# Altium schematic sheet Keys.SchDoc
size A
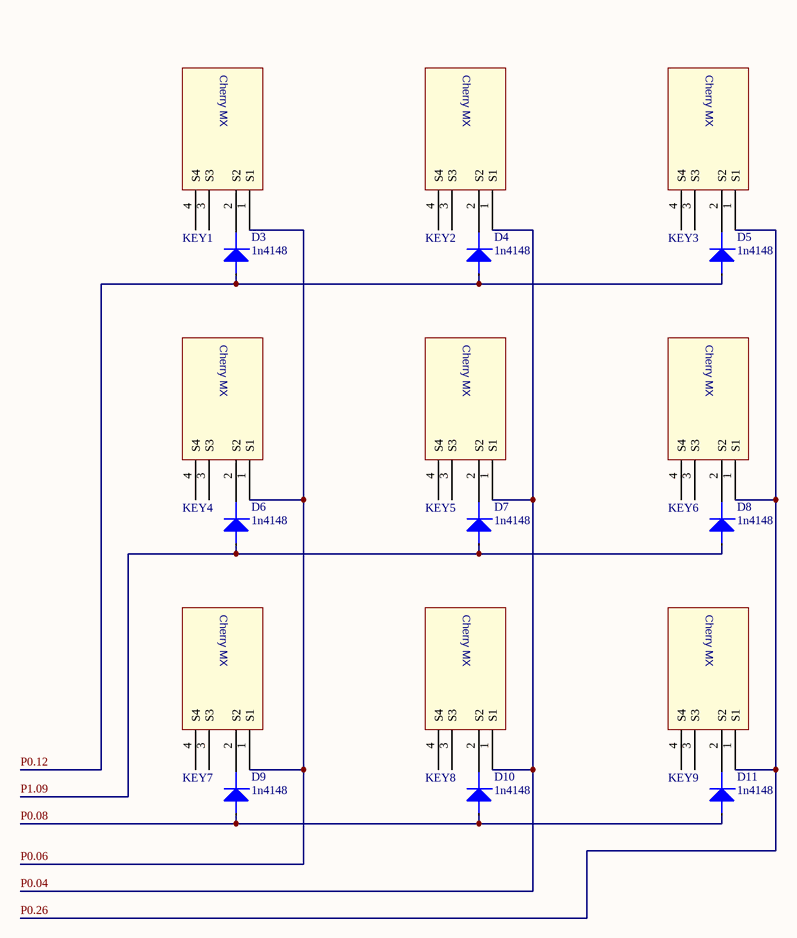
[diagram p0: Keys.SchDoc]

## Parts
D3  1n4148  [SOD-123]
D4  1n4148  [SOD-123]
D5  1n4148  [SOD-123]
D6  1n4148  [SOD-123]
D7  1n4148  [SOD-123]
D8  1n4148  [SOD-123]
D9  1n4148  [SOD-123]
D10  1n4148  [SOD-123]
D11  1n4148  [SOD-123]
KEY1  CHERRY_MX  [CHERRYMX]  (value not drawn)
KEY2  CHERRY_MX  [CHERRYMX]  (value not drawn)
KEY3  CHERRY_MX  [CHERRYMX]  (value not drawn)
KEY4  CHERRY_MX  [CHERRYMX]  (value not drawn)
KEY5  CHERRY_MX  [CHERRYMX]  (value not drawn)
KEY6  CHERRY_MX  [CHERRYMX]  (value not drawn)
KEY7  CHERRY_MX  [CHERRYMX]  (value not drawn)
KEY8  CHERRY_MX  [CHERRYMX]  (value not drawn)
KEY9  CHERRY_MX  [CHERRYMX]  (value not drawn)

## Nets
P0.04: KEY2.1(S1) KEY5.1(S1) KEY8.1(S1)
P0.06: KEY1.1(S1) KEY4.1(S1) KEY7.1(S1)
P0.08: D9.1(A) D10.1(A) D11.1(A)
P0.12: D3.1(A) D4.1(A) D5.1(A)
P0.26: KEY3.1(S1) KEY6.1(S1) KEY9.1(S1)
P1.09: D6.1(A) D7.1(A) D8.1(A)
NetD3_2: D3.2(K) KEY1.2(S2)
NetD4_2: D4.2(K) KEY2.2(S2)
NetD5_2: D5.2(K) KEY3.2(S2)
NetD6_2: D6.2(K) KEY4.2(S2)
NetD7_2: D7.2(K) KEY5.2(S2)
NetD8_2: D8.2(K) KEY6.2(S2)
NetD9_2: D9.2(K) KEY7.2(S2)
NetD10_2: D10.2(K) KEY8.2(S2)
NetD11_2: D11.2(K) KEY9.2(S2)

Not connected (* = marked no-connect by the designer): KEY1 3(S3) 4(S4); KEY2 3(S3) 4(S4); KEY3 3(S3) 4(S4); KEY4 3(S3) 4(S4); KEY5 3(S3) 4(S4); KEY6 3(S3) 4(S4); KEY7 3(S3) 4(S4); KEY8 3(S3) 4(S4); KEY9 3(S3) 4(S4)

## Notes on the sheet
- (in symbol CHERRY_MX) Cherry MX

## Library data of the parts
D3-D11 = ZENER3: Zener Diode